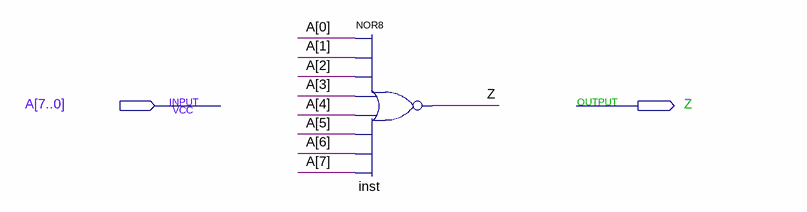
[diagram p0: schematic sheet]
// Quartus schematic Flag_Z_8b.bdf as structural Verilog: 1 symbols, 2 pins
module Flag_Z_8b (
  input  [7:0] A,
  output Z
);

  nor inst (Z, A[0], A[1], A[2], A[3], A[4], A[5], A[6], A[7]);
endmodule
